# Altium project X_Drive.PrjPcb
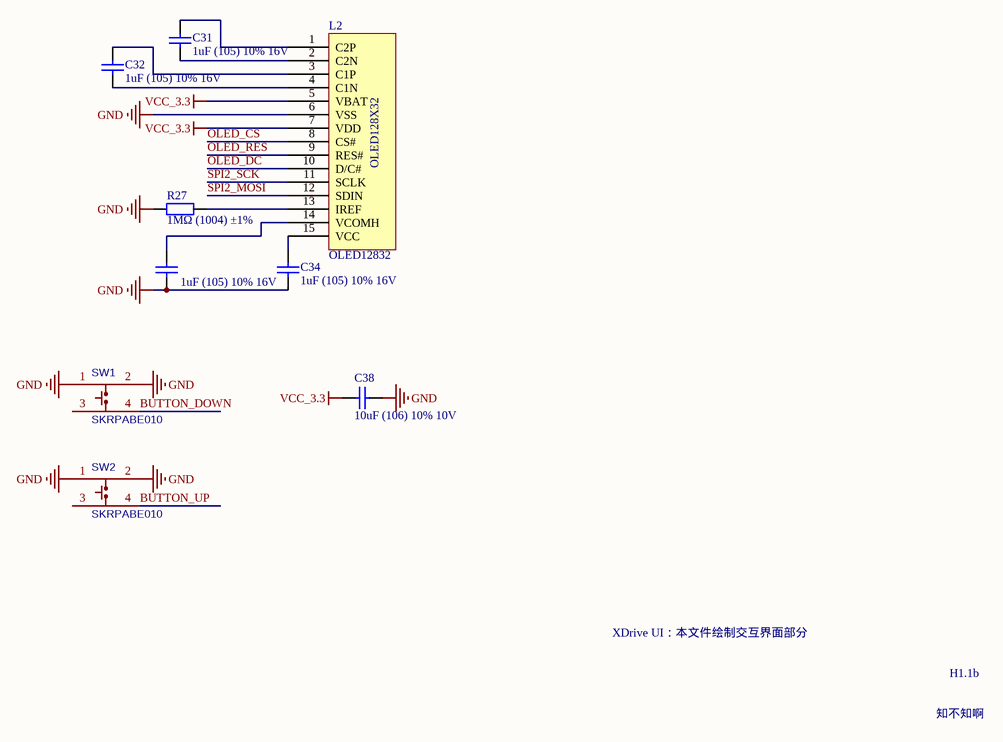
[diagram p0: UI.SchDoc]
1 sheet, 9 parts. Net scope: global (net labels, ports and power ports of the same name join across sheets).
Board files: PCB.PcbDoc, PCB - 焊接图.PcbDoc

## Sheet UI.SchDoc
size A4

### Parts
?  1uF (105) 10% 16V  [0603_C]
C31  1uF (105) 10% 16V  [0603_C]
C32  1uF (105) 10% 16V  [0603_C]
C34  1uF (105) 10% 16V  [0603_C]
C38  10uF (106) 10% 10V  [0603_C]
L2  OLED12832  [PCBComponent_1 - duplicate]
R27  1MΩ (1004) ±1%  [0603_R]
SW1  SKRPABE010  [KEY-SMD-4P_L4.20-W3.20]
SW2  SKRPABE010  [KEY-SMD-4P_L4.20-W3.20]

### Nets
GND: ?.1 C34.1 C38.1 L2.6(VSS) R27.1 SW1.1 SW1.2 SW2.1 SW2.2
VCC_3.3: C38.2 L2.5(VBAT) L2.7(VDD)
BUTTON_DOWN: SW1.4
BUTTON_UP: SW2.4
OLED_CS: L2.8(CS#)
OLED_DC: L2.10(D/C#)
OLED_RES: L2.9(RES#)
SPI2_MOSI: L2.12(SDIN)
SPI2_SCK: L2.11(SCLK)
Net?_2: ?.2 L2.14(VCOMH)
NetC31_1: C31.1 L2.2(C2N)
NetC31_2: C31.2 L2.1(C2P)
NetC32_1: C32.1 L2.4(C1N)
NetC32_2: C32.2 L2.3(C1P)
NetC34_2: C34.2 L2.15(VCC)
NetL2_13: L2.13(IREF) R27.2

Not connected (* = marked no-connect by the designer): SW1 3; SW2 3

### Notes on the sheet
- XDrive UI：本文件绘制交互界面部分
- H1.1b
- 知不知啊
- (in symbol OLED12832) OLED128X32

### Library data of the parts
? C31 C32 C34 = 0603 1uF (105) 10% 50V: 贴片电容; ComponentLink1Description: 供应商链接; ComponentLink1URL: http://www.szlcsc.com/product/details_16531.html; Package: 0603; Supplier: LC; SuppliersPartNumber: C15849
C38 = 0603 10uF (106) 10% 10V: 贴片电容; ComponentLink1Description: 供应商链接; ComponentLink1URL: http://www.szlcsc.com/product/details_20411.html; Package: 0603; Supplier: LC; SuppliersPartNumber: C19702
R27 = 0603 2MΩ (2004) 1%: 贴片电阻; ComponentLink1Description: 供应商链接; ComponentLink1URL: http://www.szlcsc.com/product/details_23703.html; Package: 0603; Supplier: LC; SuppliersPartNumber: C22976
SW1 SW2 = SKRPABE010: 4脚贴片按键; BOM_Manufacturer: ALPS; BOM_Supplier: LCSC; BOM_Manufacturer Part: SKRPABE010; BOM_Supplier Part: C115360; spicePre: S; spiceSymbolName: SKRPABE010